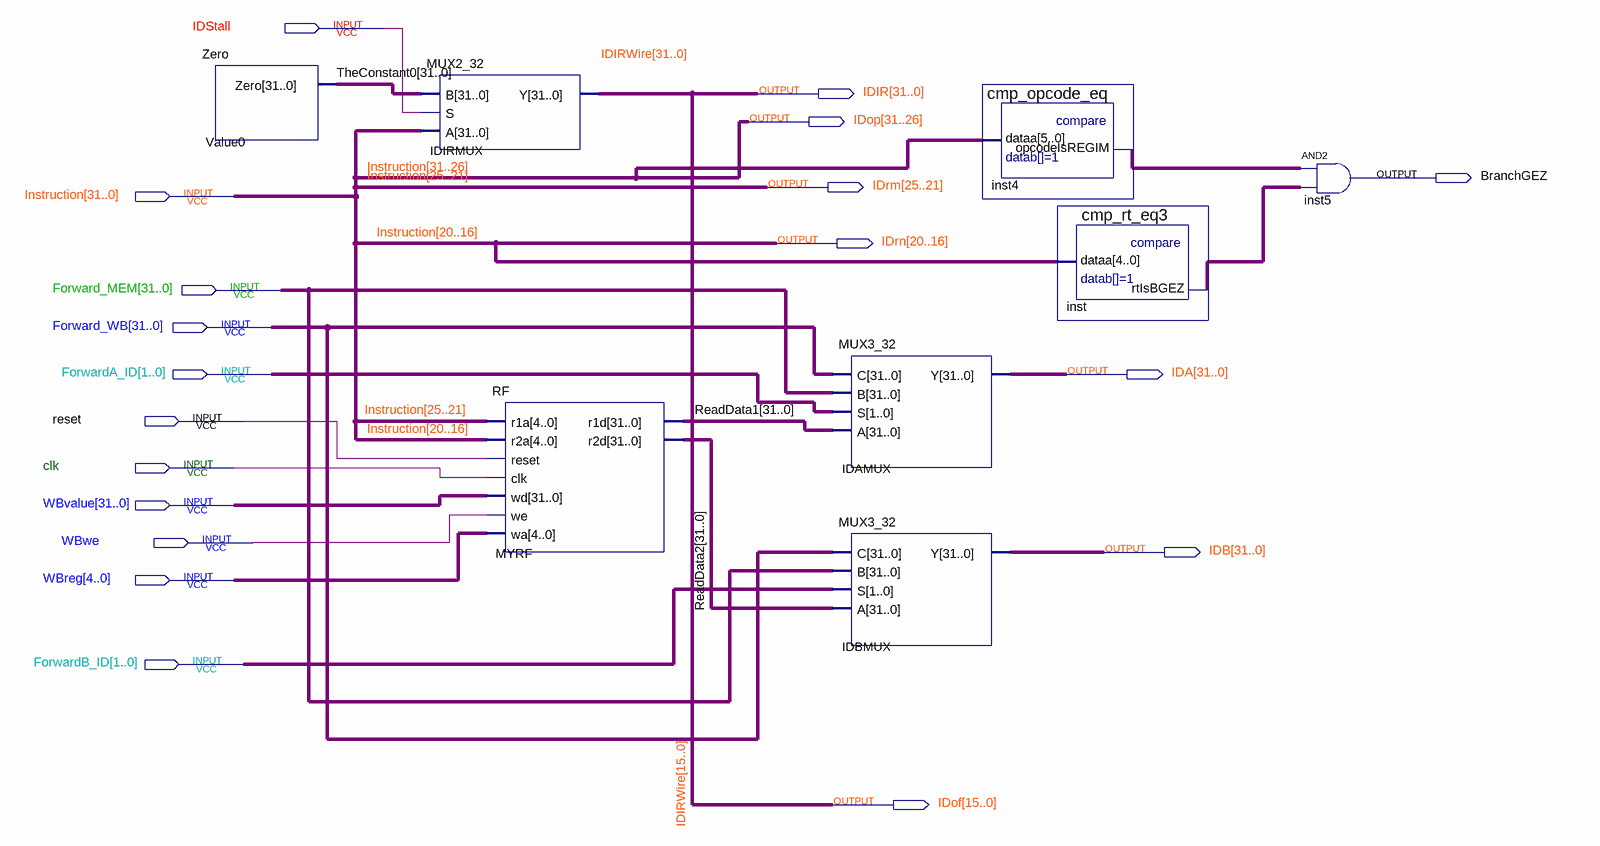
[diagram p0: schematic sheet]
// Quartus schematic ID.bdf as structural Verilog: 8 symbols, 19 pins
module ID (
  input  IDStall,
  input  [31:0] Instruction,
  input  [31:0] Forward_MEM,
  input  [31:0] Forward_WB,
  input  [1:0] ForwardA_ID,
  input  reset,
  input  clk,
  input  [31:0] WBvalue,
  input  WBwe,
  input  [4:0] WBreg,
  input  [1:0] ForwardB_ID,
  output [31:0] IDIR,
  output [31:26] IDop,
  output BranchGEZ,
  output [25:21] IDrm,
  output [20:16] IDrn,
  output [31:0] IDA,
  output [31:0] IDB,
  output [15:0] IDof
);

  wire inst4_opcodeisregim, inst_rtisbgez;
  wire [31:0] ReadData1, ReadData2, TheConstant0;

  Zero Value0 (.Zero(TheConstant0));
  MUX2_32 IDIRMUX (.B(TheConstant0), .S(IDStall), .A(Instruction), .Y(IDIR));
  RF MYRF (
    .r1a(Instruction[25:21]), .r2a(Instruction[20:16]), .reset(reset), .clk(clk), .wd(WBvalue), .we(WBwe),
    .wa(WBreg), .r1d(ReadData1), .r2d(ReadData2));
  MUX3_32 IDAMUX (.C(Forward_WB), .B(Forward_MEM), .S(ForwardA_ID), .A(ReadData1), .Y(IDA));
  MUX3_32 IDBMUX (.C(Forward_WB), .B(Forward_MEM), .S(ForwardB_ID), .A(ReadData2), .Y(IDB));
  cmp_opcode_eq inst4 (.dataa(Instruction), .opcodeIsREGIM(inst4_opcodeisregim));
  cmp_rt_eq3 inst (.dataa(Instruction[20:16]), .rtIsBGEZ(inst_rtisbgez));
  and inst5 (BranchGEZ, inst4_opcodeisregim, inst_rtisbgez);

  assign IDof = IDIR[15:0];
  assign IDop = Instruction[31:26];
  assign IDrm = Instruction[25:21];
  assign IDrn = Instruction[20:16];

  // Other names for the same wires on the sheet: IDIRWire[31:0] = IDIR
endmodule
